# EAGLE schematic tilt_brick (EAGLE 7.2.0)
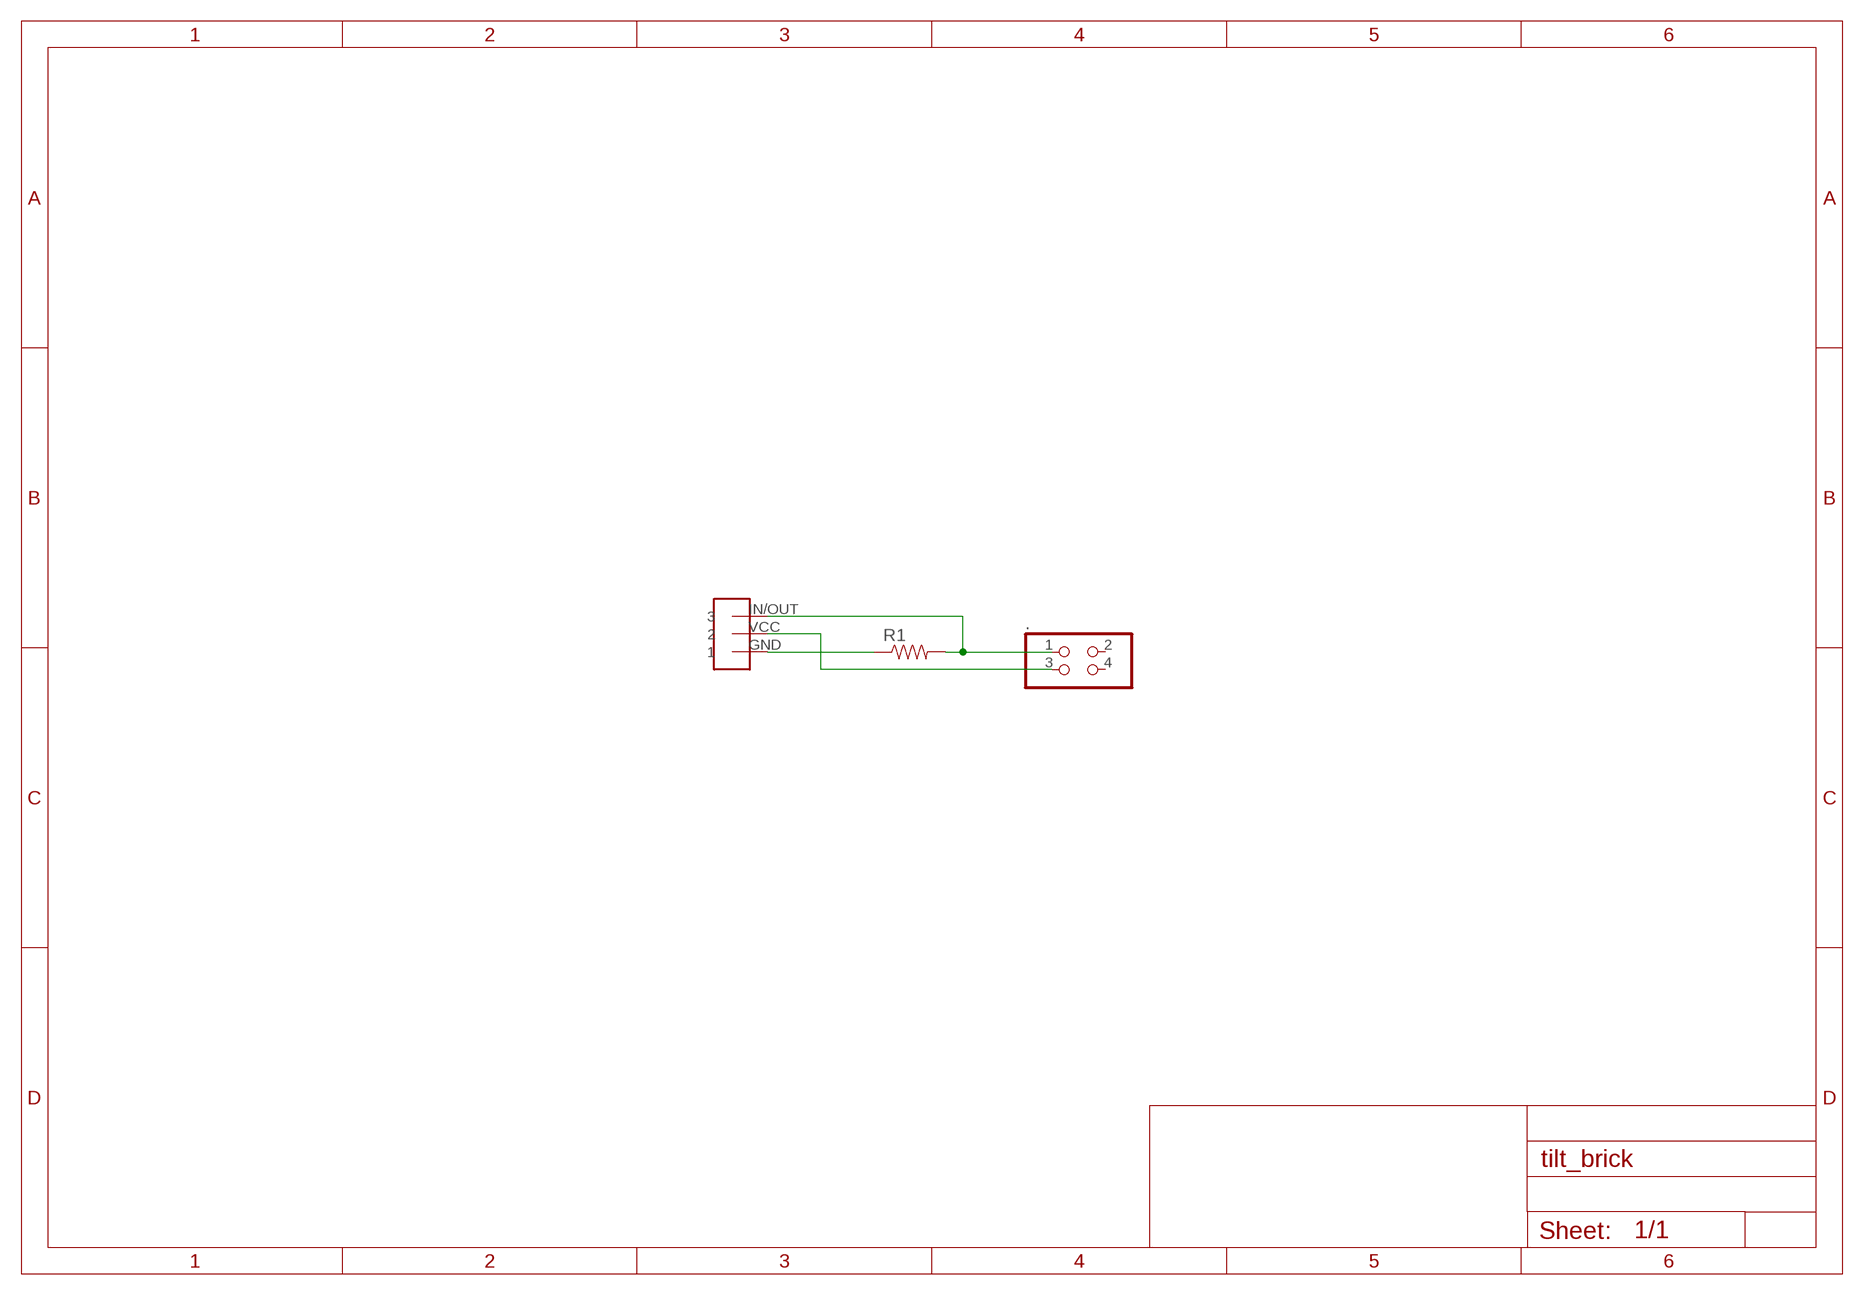
[diagram p0: schematic, sheet 1]

## Parts
.  PINHD-2X2  [2X02]
R1  RESISTORKIT  [AXIAL-0.3-KIT]
U$1  BRICK-3PIN  [BRICK_3PIN]

## Nets
GND: R1.P$1 U$1.GND
N$3: ..1 R1.P$2 U$1.IN/OUT
N$5: ..3 U$1.VCC
Unconnected: ..2 ..4

## Library data of the parts
. = pinhead:PINHD-2X2: PIN HEADER
R1 = SparkFun:RESISTOR: Resistor Basic schematic elements and footprints for 0603, 1206, and PTH resistors.
U$1 = gclue:BRICK-3PIN